# EAGLE schematic Snowflake (EAGLE 9.6.2)
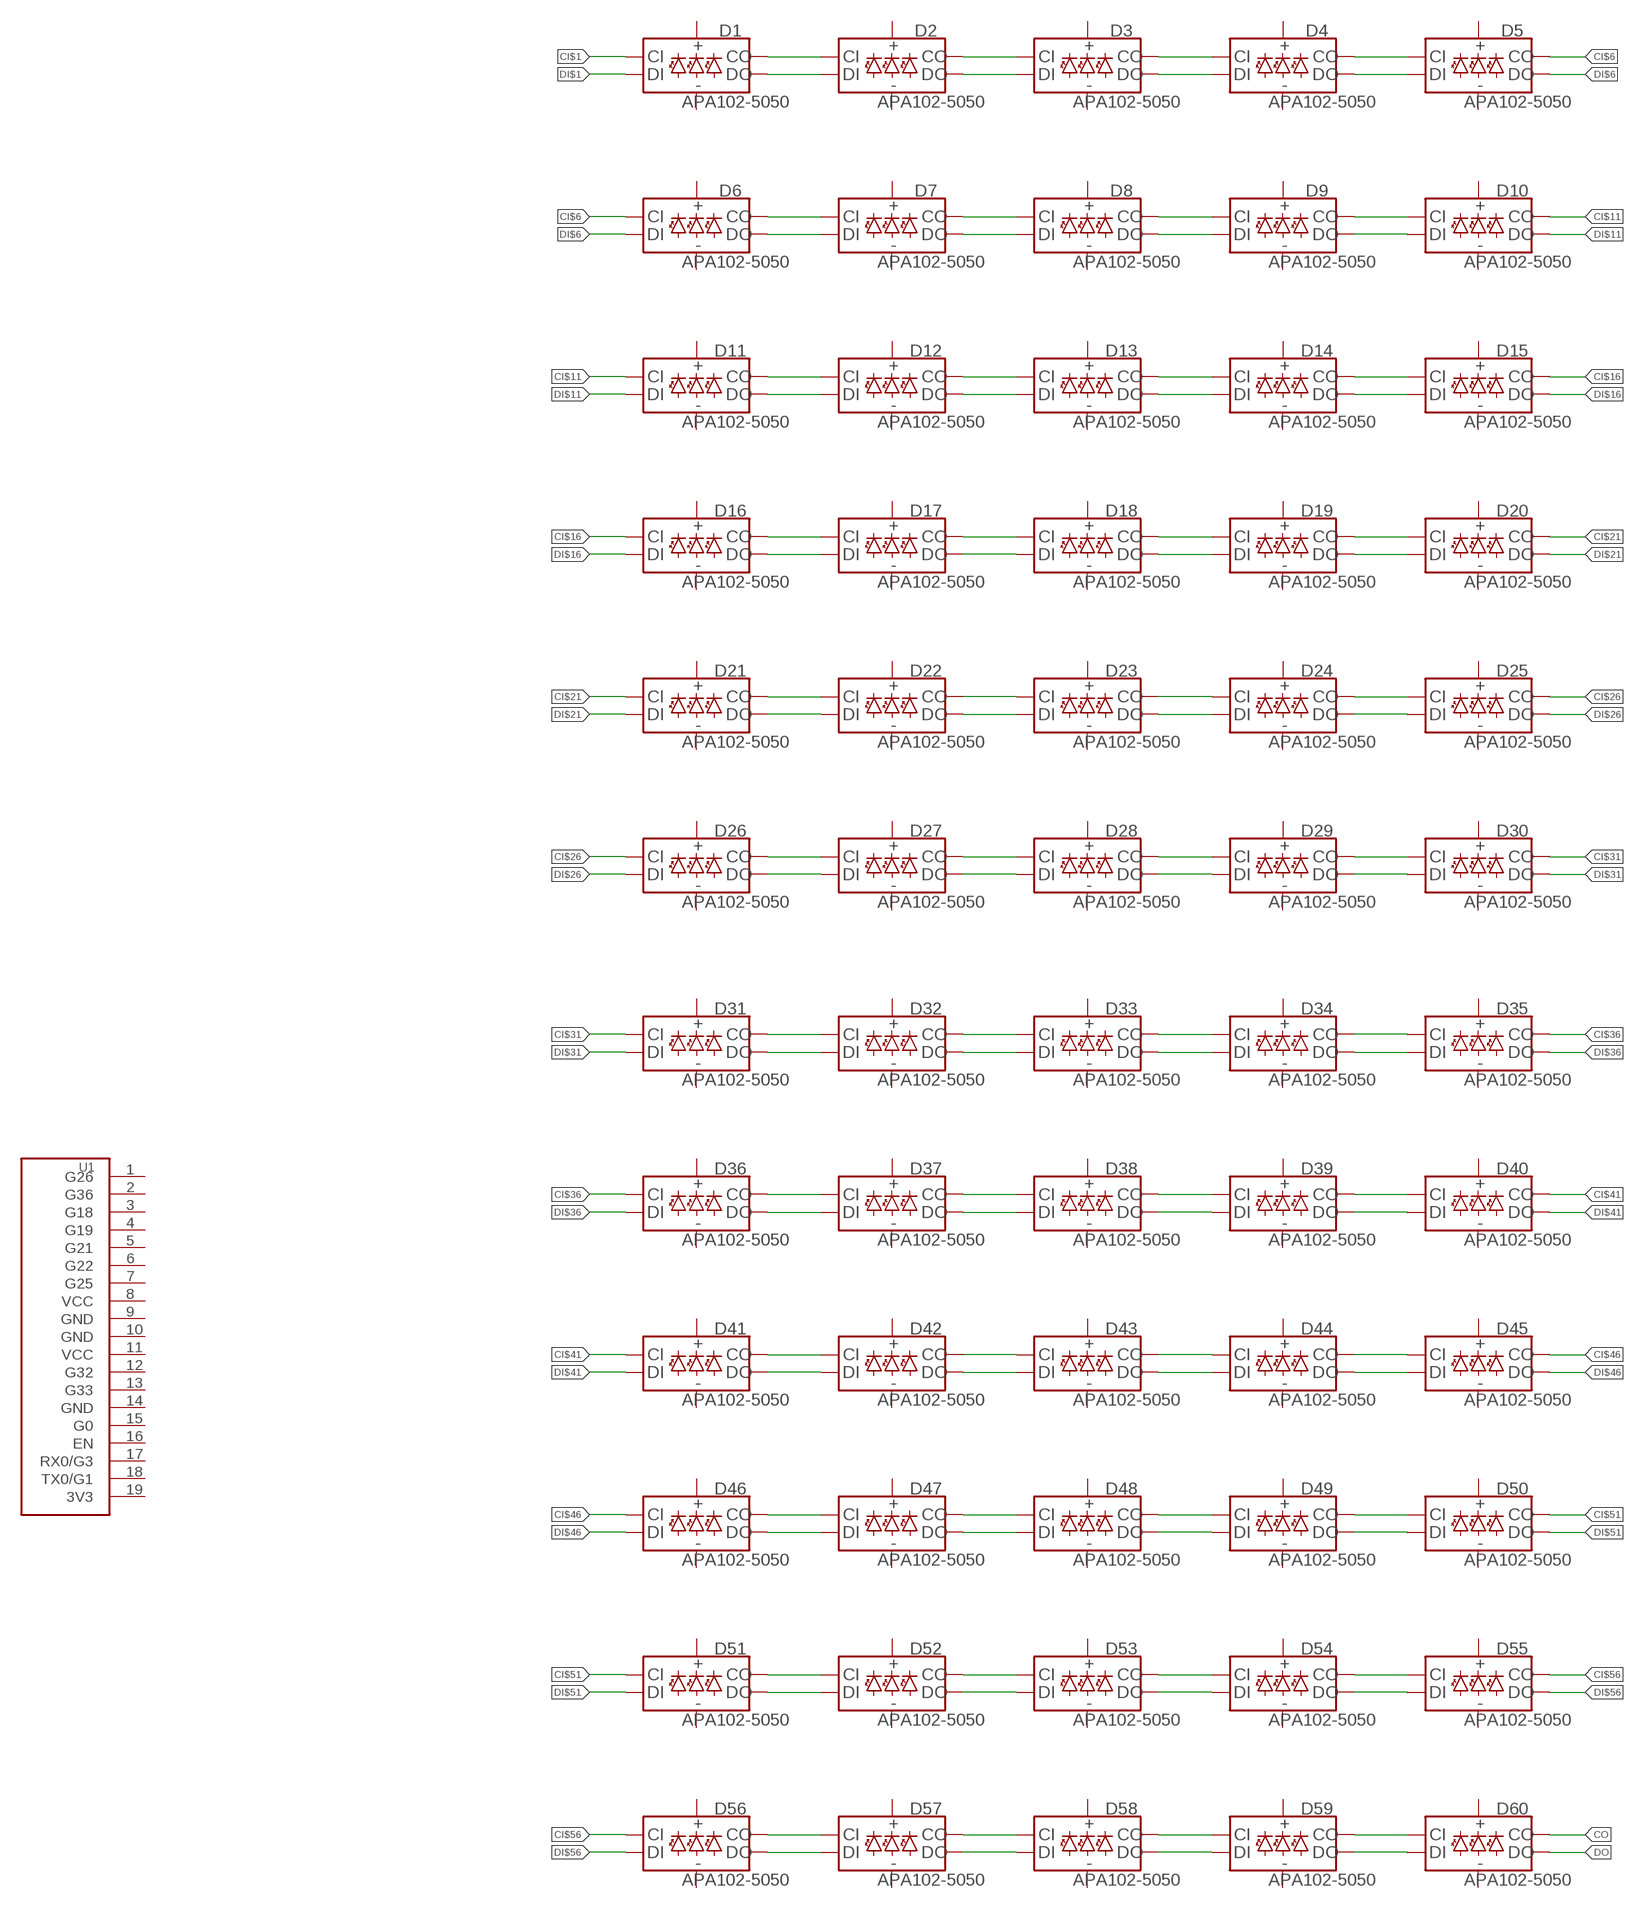
[diagram p0: schematic, sheet 1]

## Parts
D1  APA102-5050  [APA102-5050]
D2  APA102-5050  [APA102-5050]
D3  APA102-5050  [APA102-5050]
D4  APA102-5050  [APA102-5050]
D5  APA102-5050  [APA102-5050]
D6  APA102-5050  [APA102-5050]
D7  APA102-5050  [APA102-5050]
D8  APA102-5050  [APA102-5050]
D9  APA102-5050  [APA102-5050]
D10  APA102-5050  [APA102-5050]
D11  APA102-5050  [APA102-5050]
D12  APA102-5050  [APA102-5050]
D13  APA102-5050  [APA102-5050]
D14  APA102-5050  [APA102-5050]
D15  APA102-5050  [APA102-5050]
D16  APA102-5050  [APA102-5050]
D17  APA102-5050  [APA102-5050]
D18  APA102-5050  [APA102-5050]
D19  APA102-5050  [APA102-5050]
D20  APA102-5050  [APA102-5050]
D21  APA102-5050  [APA102-5050]
D22  APA102-5050  [APA102-5050]
D23  APA102-5050  [APA102-5050]
D24  APA102-5050  [APA102-5050]
D25  APA102-5050  [APA102-5050]
D26  APA102-5050  [APA102-5050]
D27  APA102-5050  [APA102-5050]
D28  APA102-5050  [APA102-5050]
D29  APA102-5050  [APA102-5050]
D30  APA102-5050  [APA102-5050]
D31  APA102-5050  [APA102-5050]
D32  APA102-5050  [APA102-5050]
D33  APA102-5050  [APA102-5050]
D34  APA102-5050  [APA102-5050]
D35  APA102-5050  [APA102-5050]
D36  APA102-5050  [APA102-5050]
D37  APA102-5050  [APA102-5050]
D38  APA102-5050  [APA102-5050]
D39  APA102-5050  [APA102-5050]
D40  APA102-5050  [APA102-5050]
D41  APA102-5050  [APA102-5050]
D42  APA102-5050  [APA102-5050]
D43  APA102-5050  [APA102-5050]
D44  APA102-5050  [APA102-5050]
D45  APA102-5050  [APA102-5050]
D46  APA102-5050  [APA102-5050]
D47  APA102-5050  [APA102-5050]
D48  APA102-5050  [APA102-5050]
D49  APA102-5050  [APA102-5050]
D50  APA102-5050  [APA102-5050]
D51  APA102-5050  [APA102-5050]
D52  APA102-5050  [APA102-5050]
D53  APA102-5050  [APA102-5050]
D54  APA102-5050  [APA102-5050]
D55  APA102-5050  [APA102-5050]
D56  APA102-5050  [APA102-5050]
D57  APA102-5050  [APA102-5050]
D58  APA102-5050  [APA102-5050]
D59  APA102-5050  [APA102-5050]
D60  APA102-5050  [APA102-5050]
U1  M5STAMP-PICO  [M5STAMP-PICO]

## Nets
CI$1: D1.P2(CI)
CI$2: D1.P5(CO) D2.P2(CI)
CI$3: D2.P5(CO) D3.P2(CI)
CI$4: D3.P5(CO) D4.P2(CI)
CI$5: D4.P5(CO) D5.P2(CI)
CI$6: D5.P5(CO) D6.P2(CI)
CI$7: D6.P5(CO) D7.P2(CI)
CI$8: D7.P5(CO) D8.P2(CI)
CI$9: D8.P5(CO) D9.P2(CI)
CI$10: D9.P5(CO) D10.P2(CI)
CI$11: D10.P5(CO) D11.P2(CI)
CI$12: D11.P5(CO) D12.P2(CI)
CI$13: D12.P5(CO) D13.P2(CI)
CI$14: D13.P5(CO) D14.P2(CI)
CI$15: D14.P5(CO) D15.P2(CI)
CI$16: D15.P5(CO) D16.P2(CI)
CI$17: D16.P5(CO) D17.P2(CI)
CI$18: D17.P5(CO) D18.P2(CI)
CI$19: D18.P5(CO) D19.P2(CI)
CI$20: D19.P5(CO) D20.P2(CI)
CI$21: D20.P5(CO) D21.P2(CI)
CI$22: D21.P5(CO) D22.P2(CI)
CI$23: D22.P5(CO) D23.P2(CI)
CI$24: D23.P5(CO) D24.P2(CI)
CI$25: D24.P5(CO) D25.P2(CI)
CI$26: D25.P5(CO) D26.P2(CI)
CI$27: D26.P5(CO) D27.P2(CI)
CI$28: D27.P5(CO) D28.P2(CI)
CI$29: D28.P5(CO) D29.P2(CI)
CI$30: D29.P5(CO) D30.P2(CI)
CI$31: D30.P5(CO) D31.P2(CI)
CI$32: D31.P5(CO) D32.P2(CI)
CI$33: D32.P5(CO) D33.P2(CI)
CI$34: D33.P5(CO) D34.P2(CI)
CI$35: D34.P5(CO) D35.P2(CI)
CI$36: D35.P5(CO) D36.P2(CI)
CI$37: D36.P5(CO) D37.P2(CI)
CI$38: D37.P5(CO) D38.P2(CI)
CI$39: D38.P5(CO) D39.P2(CI)
CI$40: D39.P5(CO) D40.P2(CI)
CI$41: D40.P5(CO) D41.P2(CI)
CI$42: D41.P5(CO) D42.P2(CI)
CI$43: D42.P5(CO) D43.P2(CI)
CI$44: D43.P5(CO) D44.P2(CI)
CI$45: D44.P5(CO) D45.P2(CI)
CI$46: D45.P5(CO) D46.P2(CI)
CI$47: D46.P5(CO) D47.P2(CI)
CI$48: D47.P5(CO) D48.P2(CI)
CI$49: D48.P5(CO) D49.P2(CI)
CI$50: D49.P5(CO) D50.P2(CI)
CI$51: D50.P5(CO) D51.P2(CI)
CI$52: D51.P5(CO) D52.P2(CI)
CI$53: D52.P5(CO) D53.P2(CI)
CI$54: D53.P5(CO) D54.P2(CI)
CI$55: D54.P5(CO) D55.P2(CI)
CI$56: D55.P5(CO) D56.P2(CI)
CI$57: D56.P5(CO) D57.P2(CI)
CI$58: D57.P5(CO) D58.P2(CI)
CI$59: D58.P5(CO) D59.P2(CI)
CI$60: D59.P5(CO) D60.P2(CI)
CO: D60.P5(CO)
DI$1: D1.P1(DI)
DI$2: D1.P6(DO) D2.P1(DI)
DI$3: D2.P6(DO) D3.P1(DI)
DI$4: D3.P6(DO) D4.P1(DI)
DI$5: D4.P6(DO) D5.P1(DI)
DI$6: D5.P6(DO) D6.P1(DI)
DI$7: D6.P6(DO) D7.P1(DI)
DI$8: D7.P6(DO) D8.P1(DI)
DI$9: D8.P6(DO) D9.P1(DI)
DI$10: D9.P6(DO) D10.P1(DI)
DI$11: D10.P6(DO) D11.P1(DI)
DI$12: D11.P6(DO) D12.P1(DI)
DI$13: D12.P6(DO) D13.P1(DI)
DI$14: D13.P6(DO) D14.P1(DI)
DI$15: D14.P6(DO) D15.P1(DI)
DI$16: D15.P6(DO) D16.P1(DI)
DI$17: D16.P6(DO) D17.P1(DI)
DI$18: D17.P6(DO) D18.P1(DI)
DI$19: D18.P6(DO) D19.P1(DI)
DI$20: D19.P6(DO) D20.P1(DI)
DI$21: D20.P6(DO) D21.P1(DI)
DI$22: D21.P6(DO) D22.P1(DI)
DI$23: D22.P6(DO) D23.P1(DI)
DI$24: D23.P6(DO) D24.P1(DI)
DI$25: D24.P6(DO) D25.P1(DI)
DI$26: D25.P6(DO) D26.P1(DI)
DI$27: D26.P6(DO) D27.P1(DI)
DI$28: D27.P6(DO) D28.P1(DI)
DI$29: D28.P6(DO) D29.P1(DI)
DI$30: D29.P6(DO) D30.P1(DI)
DI$31: D30.P6(DO) D31.P1(DI)
DI$32: D31.P6(DO) D32.P1(DI)
DI$33: D32.P6(DO) D33.P1(DI)
DI$34: D33.P6(DO) D34.P1(DI)
DI$35: D34.P6(DO) D35.P1(DI)
DI$36: D35.P6(DO) D36.P1(DI)
DI$37: D36.P6(DO) D37.P1(DI)
DI$38: D37.P6(DO) D38.P1(DI)
DI$39: D38.P6(DO) D39.P1(DI)
DI$40: D39.P6(DO) D40.P1(DI)
DI$41: D40.P6(DO) D41.P1(DI)
DI$42: D41.P6(DO) D42.P1(DI)
DI$43: D42.P6(DO) D43.P1(DI)
DI$44: D43.P6(DO) D44.P1(DI)
DI$45: D44.P6(DO) D45.P1(DI)
DI$46: D45.P6(DO) D46.P1(DI)
DI$47: D46.P6(DO) D47.P1(DI)
DI$48: D47.P6(DO) D48.P1(DI)
DI$49: D48.P6(DO) D49.P1(DI)
DI$50: D49.P6(DO) D50.P1(DI)
DI$51: D50.P6(DO) D51.P1(DI)
DI$52: D51.P6(DO) D52.P1(DI)
DI$53: D52.P6(DO) D53.P1(DI)
DI$54: D53.P6(DO) D54.P1(DI)
DI$55: D54.P6(DO) D55.P1(DI)
DI$56: D55.P6(DO) D56.P1(DI)
DI$57: D56.P6(DO) D57.P1(DI)
DI$58: D57.P6(DO) D58.P1(DI)
DI$59: D58.P6(DO) D59.P1(DI)
DI$60: D59.P6(DO) D60.P1(DI)
DO: D60.P6(DO)
Unconnected: D1.P3(GND) D1.P4(VCC) D2.P3(GND) D2.P4(VCC) D3.P3(GND) D3.P4(VCC) D4.P3(GND) D4.P4(VCC) D5.P3(GND) D5.P4(VCC) D6.P3(GND) D6.P4(VCC) D7.P3(GND) D7.P4(VCC) D8.P3(GND) D8.P4(VCC) D9.P3(GND) D9.P4(VCC) D10.P3(GND) D10.P4(VCC) D11.P3(GND) D11.P4(VCC) D12.P3(GND) D12.P4(VCC) D13.P3(GND) D13.P4(VCC) D14.P3(GND) D14.P4(VCC) D15.P3(GND) D15.P4(VCC) D16.P3(GND) D16.P4(VCC) D17.P3(GND) D17.P4(VCC) D18.P3(GND) D18.P4(VCC) D19.P3(GND) D19.P4(VCC) D20.P3(GND) D20.P4(VCC) D21.P3(GND) D21.P4(VCC) D22.P3(GND) D22.P4(VCC) D23.P3(GND) D23.P4(VCC) D24.P3(GND) D24.P4(VCC) D25.P3(GND) D25.P4(VCC) D26.P3(GND) D26.P4(VCC) D27.P3(GND) D27.P4(VCC) D28.P3(GND) D28.P4(VCC) D29.P3(GND) D29.P4(VCC) D30.P3(GND) D30.P4(VCC) D31.P3(GND) D31.P4(VCC) D32.P3(GND) D32.P4(VCC) D33.P3(GND) D33.P4(VCC) D34.P3(GND) D34.P4(VCC) D35.P3(GND) D35.P4(VCC) D36.P3(GND) D36.P4(VCC) D37.P3(GND) D37.P4(VCC) D38.P3(GND) D38.P4(VCC) D39.P3(GND) D39.P4(VCC) D40.P3(GND) D40.P4(VCC) D41.P3(GND) D41.P4(VCC) D42.P3(GND) D42.P4(VCC) D43.P3(GND) D43.P4(VCC) D44.P3(GND) D44.P4(VCC) D45.P3(GND) D45.P4(VCC) D46.P3(GND) D46.P4(VCC) D47.P3(GND) D47.P4(VCC) D48.P3(GND) D48.P4(VCC) D49.P3(GND) D49.P4(VCC) D50.P3(GND) D50.P4(VCC) D51.P3(GND) D51.P4(VCC) D52.P3(GND) D52.P4(VCC) D53.P3(GND) D53.P4(VCC) D54.P3(GND) D54.P4(VCC) D55.P3(GND) D55.P4(VCC) D56.P3(GND) D56.P4(VCC) D57.P3(GND) D57.P4(VCC) D58.P3(GND) D58.P4(VCC) D59.P3(GND) D59.P4(VCC) D60.P3(GND) D60.P4(VCC) U1.1(G26) U1.2(G36) U1.3(G18) U1.4(G19) U1.5(G21) U1.6(G22) U1.7(G25) U1.12(G32) U1.13(G33) U1.15(G0) U1.16(EN) U1.17(RX0/G3) U1.18(TX0/G1)

## Power pins joined to a net without a drawn wire
3V3: U1.19(3V3)
GND: U1.9(GND) U1.10(GND) U1.14(GND)
VCC: U1.8(VCC) U1.11(VCC)

## Library data of the parts
D1-D60 = SparkFun-LED:APA102: Addressable RGB LED - 2 Wire Common names: APA102, Dotstar, etc. Packages: 5050 2020 SparkFun Products: SparkFun Lumenati Boards <https://www.sparkfun.com/categories/405>; PROD_ID: DIO-13739
U1 = custom:M5STAMP-PICO: M5 Stamp Pico <https://docs.m5stack.com/en/core/stamp_pico>